# Altium schematic sheet CurrentAmpl.SchDoc
size A4
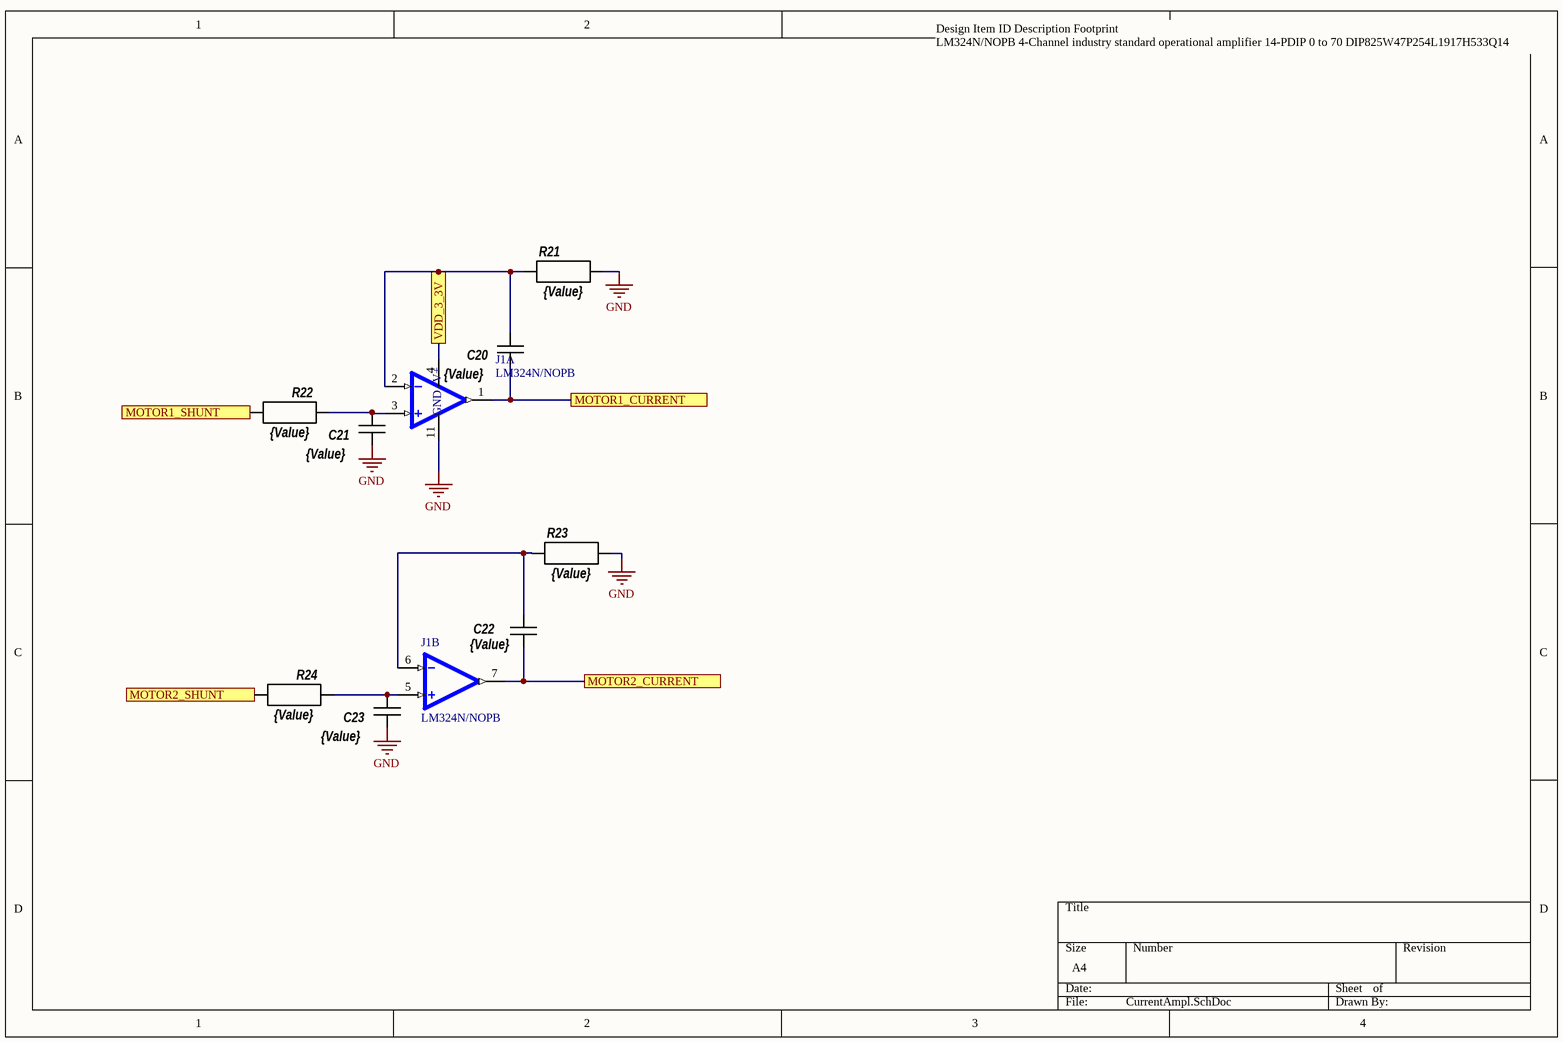
[diagram p0: CurrentAmpl.SchDoc]

## Parts
C20  value {Value}  [C0805]  (hidden comment: Cap 0805)
C21  value {Value}  [C0805]  (hidden comment: Cap 0805)
C22  value {Value}  [C0805]  (hidden comment: Cap 0805)
C23  value {Value}  [C0805]  (hidden comment: Cap 0805)
J1  LM324N/NOPB  [DIP825W47P254L1917H533Q14]  (parts A,B of 4)
R21  value {Value}  [R0805]  (hidden comment: Res 0805)
R22  value {Value}  [R0805]  (hidden comment: Res 0805)
R23  value {Value}  [R0805]  (hidden comment: Res 0805)
R24  value {Value}  [R0805]  (hidden comment: Res 0805)

## Ports
MOTOR1_CURRENT, MOTOR1_SHUNT, MOTOR2_CURRENT, MOTOR2_SHUNT, VDD_3_3V

## Nets
GND: C21.2 C23.2 J1.11(GND) R21.1 R23.1
MOTOR1_CURRENT: C20.2 J1.1(1OUT) ; port MOTOR1_CURRENT
MOTOR1_SHUNT: R22.1 ; port MOTOR1_SHUNT
MOTOR2_CURRENT: C22.2 J1.7(2OUT) ; port MOTOR2_CURRENT
MOTOR2_SHUNT: R24.1 ; port MOTOR2_SHUNT
VDD_3_3V: C20.1 J1.2(1IN-) J1.4(V+) R21.2 ; port VDD_3_3V
NetC21_1: C21.1 J1.3(1IN+) R22.2
NetC22_1: C22.1 J1.6(2IN-) R23.2
NetC23_1: C23.1 J1.5(2IN+) R24.2

## Notes on the sheet
- Design Item ID	Description	Footprint
  LM324N/NOPB	4-Channel industry standard operational amplifier 14-PDIP 0 to 70	DIP825W47P254L1917H533Q14

## Library data of the parts
C20-C23 = Cap 0805: Конденсатор 0805; Manufacturer: Murata; sm_pins: 2; th_pins: 0; Model: 0805
J1 = LM324N/NOPB: 4-Channel industry standard operational amplifier 14-PDIP 0 to 70; MP: LM324N; MF: Texas Instruments; Purchase-URL: https://pricing.snapeda.com/search/part/LM324N/?ref=eda; Package: PDIP-14 Texas Instruments; Price: None; Value: *; Availability: Good; Check_prices: https://www.snapeda.com/parts/LM324N/Texas%20Instruments/view-part/295/?ref=eda; SnapEDA_Link: https://www.snapeda.com/parts/LM324N/Texas%20Instruments/view-part/295/?ref=snap
R21-R24 = Res 0805: Резистор 0805; Manufacturer: Yageo; sm_pins: 2; th_pins: 0; Model: *